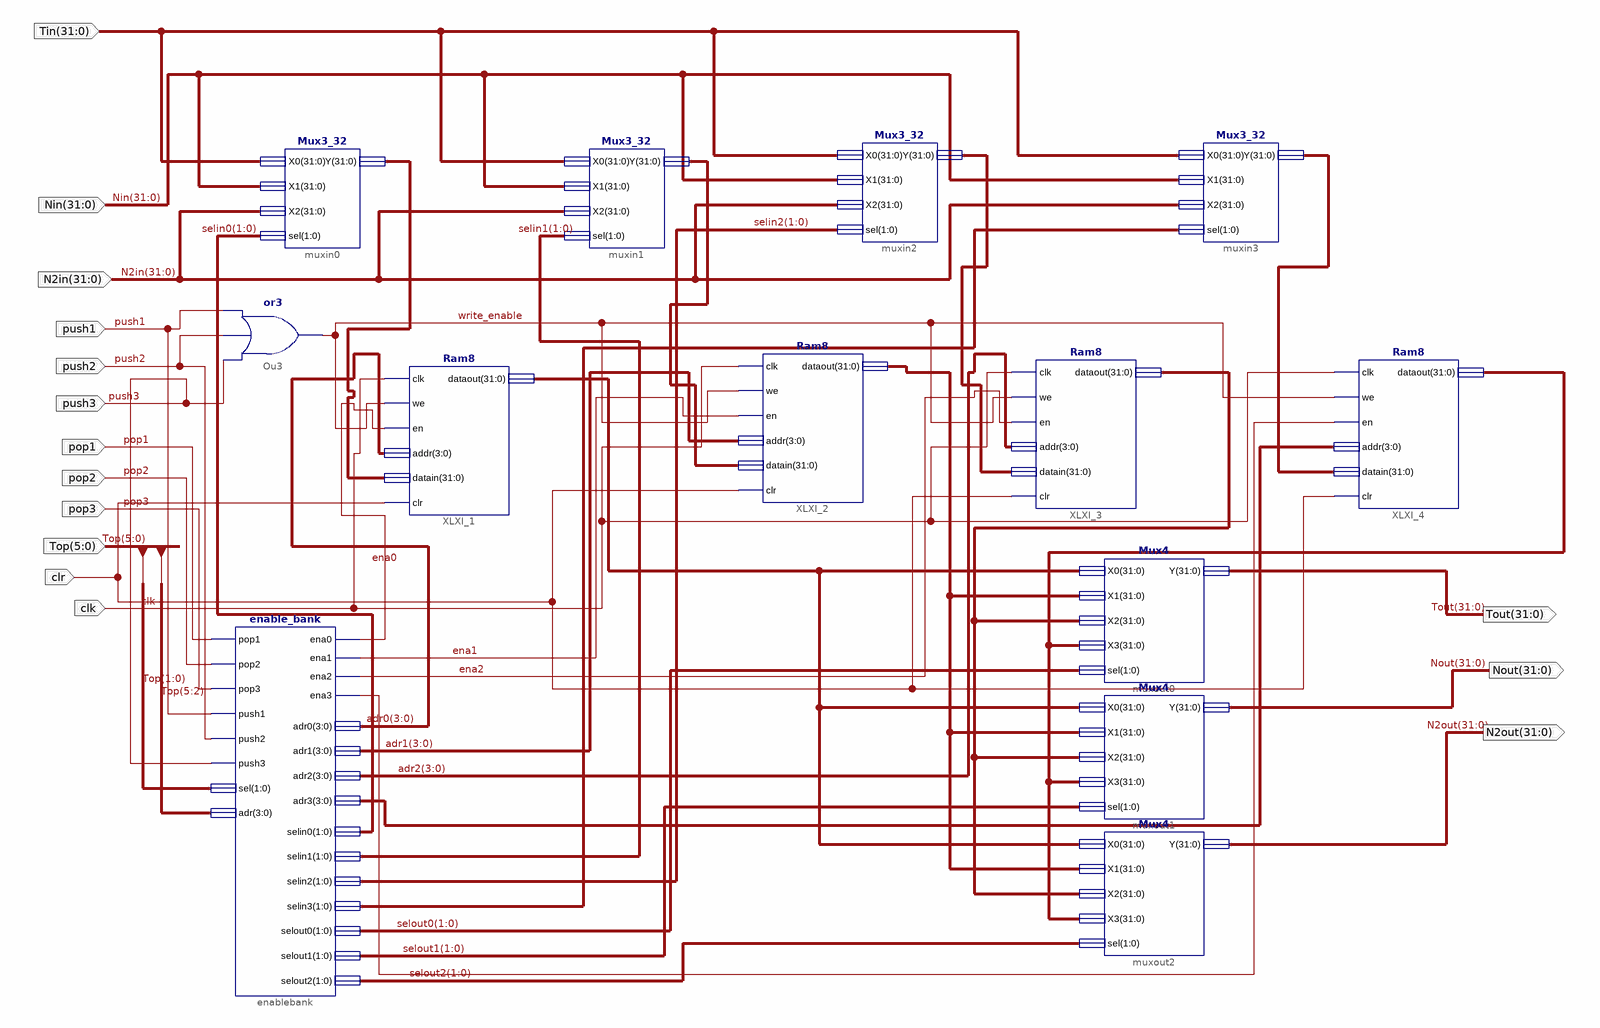
[diagram p0: schematic sheet 1]
// Xilinx ISE schematic stack.sch (virtex6) as structural Verilog: 13 symbols, 15 ports
module stack (
  input  [31:0] Nin,
  input  [31:0] N2in,
  input  push1,
  input  push2,
  input  push3,
  input  pop1,
  input  pop2,
  input  pop3,
  input  [5:0] Top,
  input  clk,
  input  [31:0] Tin,
  input  clr,
  output [31:0] Tout,
  output [31:0] N2out,
  output [31:0] Nout
);

  wire ena0, ena1, ena2, write_enable, XLXN_106;
  wire [1:0] selin0, selin1, selin2, selin3, selout0, selout1, selout2;
  wire [3:0] adr0, adr1, adr2, XLXN_103;
  wire [31:0] XLXN_22, XLXN_43, XLXN_44, XLXN_45, XLXN_53, XLXN_92, XLXN_96, XLXN_97;

  or Ou3 (write_enable, push3, push2, push1);
  enable_bank enablebank (
    .pop1(pop1), .pop2(pop2), .pop3(pop3), .push1(push1), .push2(push2), .push3(push3), .sel(Top[1:0]),
    .adr(Top[5:2]), .ena0(ena0), .ena1(ena1), .ena2(ena2), .ena3(XLXN_106), .adr0(adr0), .adr1(adr1),
    .adr2(adr2), .adr3(XLXN_103), .selin0(selin0), .selin1(selin1), .selin2(selin2), .selin3(selin3),
    .selout0(selout0), .selout1(selout1), .selout2(selout2));
  Mux4 muxout0 (.X0(XLXN_43), .X1(XLXN_44), .X2(XLXN_45), .X3(XLXN_92), .sel(selout0), .Y(Tout));
  Mux4 muxout1 (.X0(XLXN_43), .X1(XLXN_44), .X2(XLXN_45), .X3(XLXN_92), .sel(selout1), .Y(Nout));
  Mux4 muxout2 (.X0(XLXN_43), .X1(XLXN_44), .X2(XLXN_45), .X3(XLXN_92), .sel(selout2), .Y(N2out));
  Mux3_32 muxin0 (.X0(Tin), .X1(Nin), .X2(N2in), .sel(selin0), .Y(XLXN_53));
  Mux3_32 muxin2 (.X0(Tin), .X1(Nin), .X2(N2in), .sel(selin2), .Y(XLXN_96));
  Mux3_32 muxin3 (.X0(Tin), .X1(Nin), .X2(N2in), .sel(selin3), .Y(XLXN_97));
  Mux3_32 muxin1 (.X0(Tin), .X1(Nin), .X2(N2in), .sel(selin1), .Y(XLXN_22));
  Ram8 XLXI_1 (.clk(clk), .we(write_enable), .en(ena0), .addr(adr0), .datain(XLXN_53), .dataout(XLXN_43), .clr(clr));
  Ram8 XLXI_2 (.clk(clk), .we(write_enable), .en(ena1), .addr(adr1), .datain(XLXN_22), .dataout(XLXN_44), .clr(clr));
  Ram8 XLXI_4 (
    .clk(clk), .we(write_enable), .en(XLXN_106), .addr(XLXN_103), .datain(XLXN_97), .dataout(XLXN_92),
    .clr(clr));
  Ram8 XLXI_3 (.clk(clk), .we(write_enable), .en(ena2), .addr(adr2), .datain(XLXN_96), .dataout(XLXN_45), .clr(clr));

  // Notes on the sheet:
  //   clock_signal on signal clk = yes
endmodule
